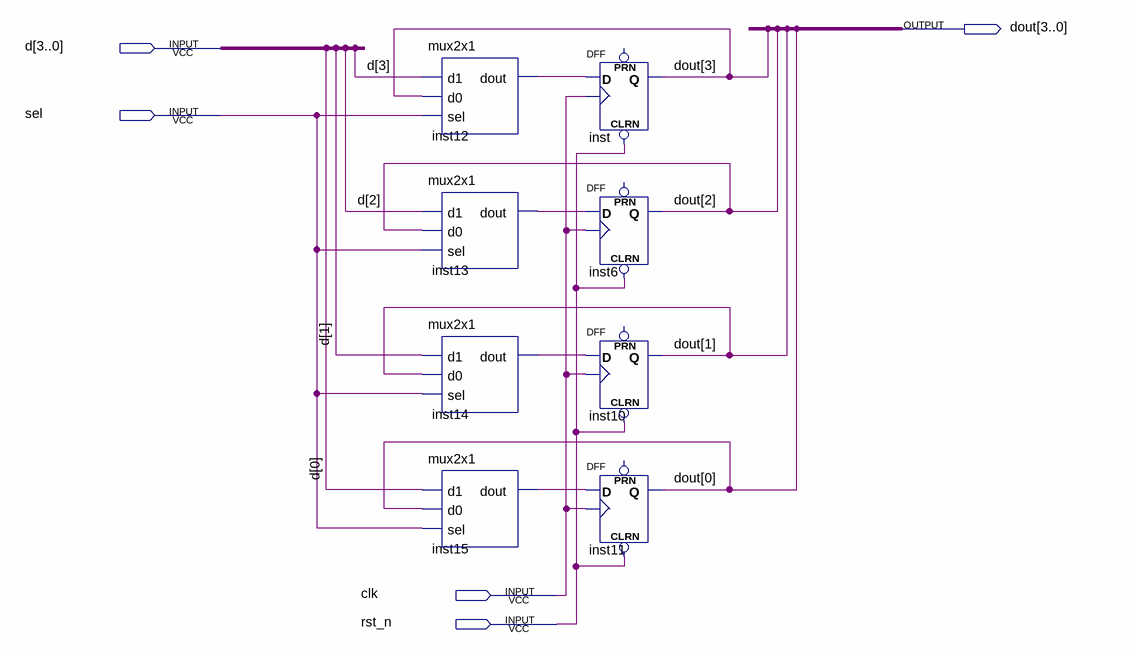
[diagram p0: schematic sheet]
// Quartus schematic fbitreg.bdf as structural Verilog: 8 symbols, 5 pins
module fbitreg (
  input  [3:0] d,
  input  sel,
  input  clk,
  input  rst_n,
  output [3:0] dout
);

  wire inst12_dout, inst13_dout, inst14_dout, inst15_dout;

  mux2x1 inst12 (.d1(d[3]), .d0(dout[3]), .sel(sel), .dout(inst12_dout));
  mux2x1 inst13 (.d1(d[2]), .d0(dout[2]), .sel(sel), .dout(inst13_dout));
  mux2x1 inst14 (.d1(d[1]), .d0(dout[1]), .sel(sel), .dout(inst14_dout));
  mux2x1 inst15 (.d1(d[0]), .d0(dout[0]), .sel(sel), .dout(inst15_dout));
  DFF inst (.CLRN(rst_n), .CLK(clk), .D(inst12_dout), .Q(dout[3]));  // open: PRN
  DFF inst6 (.CLRN(rst_n), .CLK(clk), .D(inst13_dout), .Q(dout[2]));  // open: PRN
  DFF inst10 (.CLRN(rst_n), .CLK(clk), .D(inst14_dout), .Q(dout[1]));  // open: PRN
  DFF inst11 (.CLRN(rst_n), .CLK(clk), .D(inst15_dout), .Q(dout[0]));  // open: PRN
endmodule
